# EAGLE design SenseLoRa LoRa Receiver V1.0 (EAGLE 6.1)
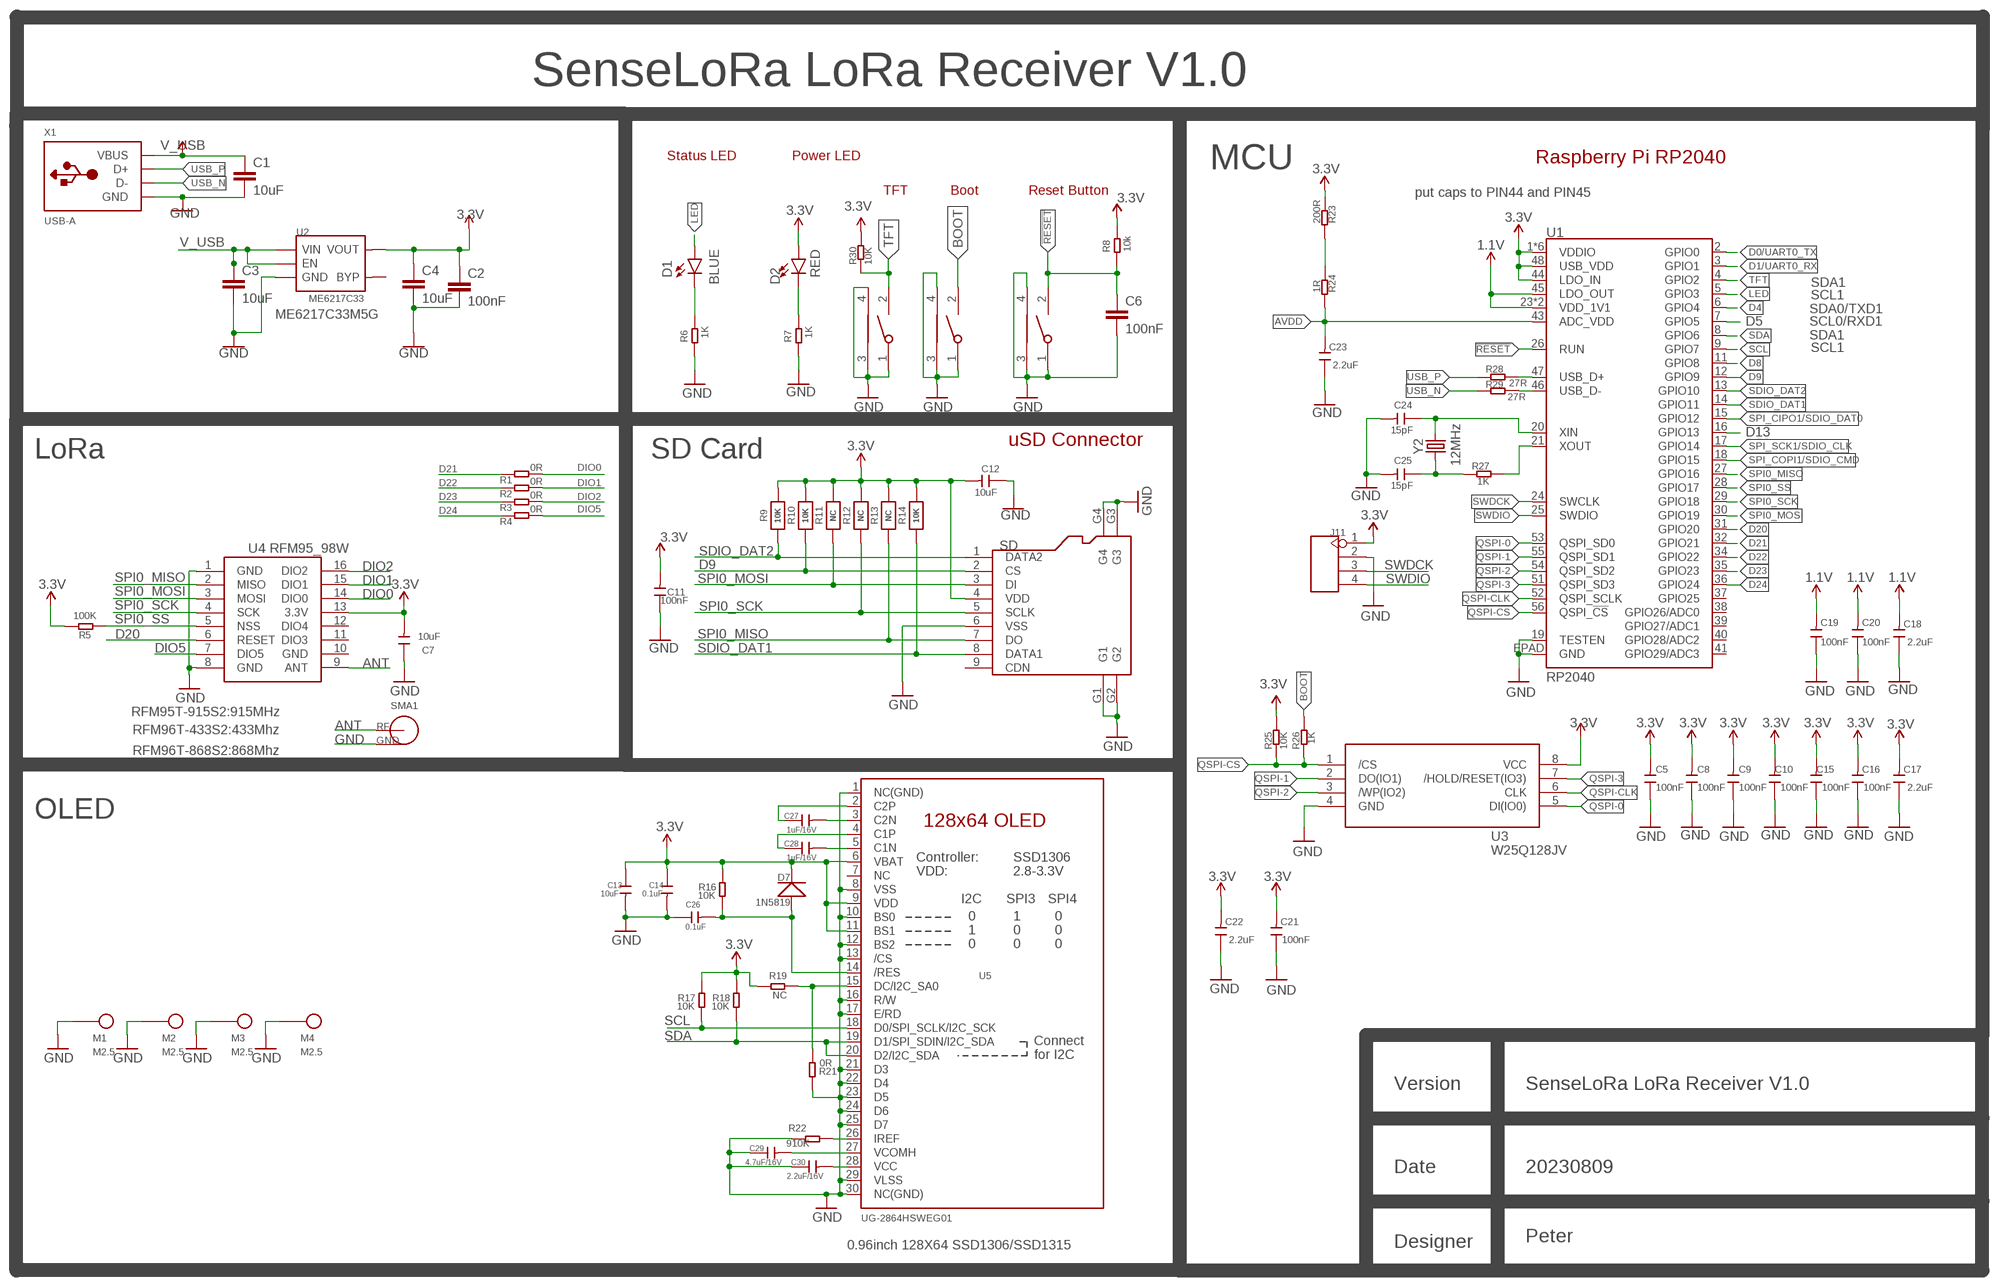
[diagram p0: schematic, sheet 1]

## Parts
BOOT  TS24CA  [2*4*3.5MM]
C1  10uF  C0603  [C0603]
C2  100nF  C0603  [C0603]
C3  10uF  C0603  [C0603]
C4  10uF  C0603  [C0603]
C5  100nF  C-0603  [C0603]
C6  100nF  C0603  [C0603]
C7  10uF  C-0603  [C0603]
C8  100nF  C-0603  [C0603]
C9  100nF  C-0603  [C0603]
C10  100nF  C-0603  [C0603]
C11  100nF  C-0603  [C0603]
C12  10uF  DISCRETE_C-0603  [DISCRETE_C0603]
C13  10uF  C-0603  [C0603]
C14  0.1uF  C-0603  [C0603]
C15  100nF  C-0603  [C0603]
C16  100nF  C-0603  [C0603]
C17  2.2uF  C-0603  [C0603]
C18  2.2uF  C-0603  [C0603]
C19  100nF  C-0603  [C0603]
C20  100nF  C-0603  [C0603]
C21  100nF  C-0603  [C0603]
C22  2.2uF  C-0603  [C0603]
C23  2.2uF  C-0603  [C0603]
C24  15pF  C-0603  [C0603]
C25  15pF  C-0603  [C0603]
C26  0.1uF  C-0603  [C0603]
C27  1uF/16V  C-0603  [C0603]
C28  1uF/16V  C-0603  [C0603]
C29  4.7uF/16V  C-0603  [C0603]
C30  2.2uF/16V  C-0603  [C0603]
D1  BLUE  LED-BLUE0603  [LED-0603]
D2  RED  LED-RED0603  [LED-0603]
D7  1N5819  D'0805'  [SOD323]
J11  HEADER-4P-60/35MILROUND  [4P-65/35ROUND]
M1  M2.5  [M2.5]
M2  M2.5  [M2.5]
M3  M2.5  [M2.5]
M4  M2.5  [M2.5]
R1  0R  R-0603  [0603]
R2  0R  R-0603  [0603]
R3  0R  R-0603  [0603]
R4  0R  R-0603  [0603]
R5  100K  R-0603  [0603]
R6  1K  R-0603  [0603]
R7  1K  R-0603  [0603]
R8  10k  R-0603  [0603]
R9  10K  RESISTOR_0603_NOOUT  [0603-NO]
R10  10K  RESISTOR_0603_NOOUT  [0603-NO]
R11  NC  RESISTOR_0603_NOOUT  [0603-NO]
R12  NC  RESISTOR_0603_NOOUT  [0603-NO]
R13  NC  RESISTOR_0603_NOOUT  [0603-NO]
R14  10K  RESISTOR_0603_NOOUT  [0603-NO]
R16  10K  R-0603  [0603]
R17  10K  R-0603  [0603]
R18  10K  R-0603  [0603]
R19  NC  R-0603  [0603]
R21  0R  R-0603  [0603]
R22  910K  R-0603  [0603]
R23  200R  R-0603  [0603]
R24  1R  R-0603  [0603]
R25  10K  R-0603  [0603]
R26  1K  R-0603  [0603]
R27  1K  R-0603  [0603]
R28  27R  R-0603  [0603]
R29  27R  R-0603  [0603]
R30  10K  R-0603  [0603]
RST  TS24CA  [2*4*3.5MM]
SD  HOLDER-MICROSD-9P  [9P-SMD-W/-RING]
SMA1  SMA-KWE  [SMA-KWE]
TFT  TS24CA  [2*4*3.5MM]
U1  RP2040  [QFN-56]
U2  ME6217C33  SPX3819  [SOT23-5]
U3  W25Q128JV  [SOIC-8-208MIL]
U4  RFM95_98W  RFM92_93W  [RFM92_93W]
U5  UG-2864HSWEG01  DISP_OLED_UG-2864HSWEG010.96"  [UG-2864HSWEG01_0.96IN_WRAPAROUND]
X1  USB-A  [MOLEX_480371000]
Y2  12MHz  CRYSTAL-12MHZ  [CRYSTAL-SMD-2X2.5MM]

## Nets
1.1V: C18.2 C19.2 C20.2 U1.23(VDD_1V1) U1.45(LDO_OUT) U1.50(VDD_1V1)
3.3V: C2.1 C4.1 C5.2 C7.2 C8.2 C9.2 C10.2 C11.2 C12.2 C13.1 C14.1 C15.2 C16.2 C17.2 C21.2 C22.2 D2.A D7.- J11.1 R5.2 R8.1 R9.2 R10.2 R11.2 R12.2 R13.2 R14.2 R16.2 R17.2 R18.2 R19.2 R23.2 R25.1 R30.1 SD.4(VDD) U1.1(VDDIO) U1.10(VDDIO) U1.22(VDDIO) U1.33(VDDIO) U1.42(VDDIO) U1.44(LDO_IN) U1.48(USB_VDD) U1.49(VDDIO) U2.5(VOUT) U3.8(VCC) U4.13(3.3V) U5.6(VBAT) U5.9(VDD) U5.11(BS1)
!RESET!: C6.1 R8.2 RST.2 U1.26(RUN)
ADC_VREF: R23.1 R24.2
ANT: SMA1.1(SIG) U4.9(ANT)
AVDD: C23.2 R24.1 U1.43(ADC_VDD)
BOOT: BOOT.2 R26.1
D0/UART0_TX: U1.2(GPIO0)
D1/UART0_RX: U1.3(GPIO1)
D4: U1.6(GPIO4)
D5: U1.7(GPIO5)
D8: U1.11(GPIO8)
D9: R10.1 SD.2(CS) U1.12(GPIO9)
D13: U1.16(GPIO13)
D20: U1.31(GPIO20) U4.6(RESET)
D21: R1.2 U1.32(GPIO21)
D22: R2.2 U1.34(GPIO22)
D23: R3.2 U1.35(GPIO23)
D24: R4.2 U1.36(GPIO24)
DIO0: R1.1 U4.14(DIO0)
DIO1: R2.1 U4.15(DIO1)
DIO2: R3.1 U4.16(DIO2)
DIO5: R4.1 U4.7(DIO5)
GND: BOOT.1 BOOT.3 BOOT.4 C1.2 C2.2 C3.2 C4.2 C5.1 C6.2 C7.1 C8.1 C9.1 C10.1 C11.1 C12.1 C13.2 C14.2 C15.1 C16.1 C17.1 C18.1 C19.1 C20.1 C21.1 C22.1 C23.1 C24.2 C25.2 C26.1 C29.1 C30.1 J11.2 M1.1 M2.1 M3.1 M4.1 R6.2 R7.2 R21.2 R22.2 RST.1 RST.3 RST.4 SD.6(VSS) SD.G1 SD.G2 SD.G3 SD.G4 SMA1.2(GND) SMA1.3(GND) SMA1.4(GND) SMA1.5(GND) TFT.1 TFT.3 TFT.4 U1.19(TESTEN) U1.EPAD(GND) U2.2(GND) U3.4(GND) U4.1(GND) U4.8(GND) U5.1(NC(GND)) U5.8(VSS) U5.10(BS0) U5.12(BS2) U5.13(/CS) U5.16(R/W) U5.17(E/RD) U5.21(D3) U5.22(D4) U5.23(D5) U5.24(D6) U5.25(D7) U5.29(VLSS) U5.30(NC(GND)) X1.4(GND)
LED: D1.A U1.5(GPIO3)
N$1: C24.1 U1.20(XIN) Y2.P3
N$2: D1.C R6.1
N$3: R19.1 R21.1 U5.15(DC/I2C_SA0)
N$4: R27.1 U1.21(XOUT)
N$5: C29.2 U5.27(VCOMH)
N$6: C25.1 R27.2 Y2.P1
N$7: D2.C R7.1
N$8: C30.2 U5.28(VCC)
N$9: R22.1 U5.26(IREF)
N$10: C27.2 U5.3(C2N)
N$13: C27.1 U5.2(C2P)
N$14: C28.1 U5.4(C1P)
N$15: C28.2 U5.5(C1N)
N$20: C26.2 D7.+ R16.1 U5.14(/RES)
QSPI-0: U1.53(QSPI_SD0) U3.5(DI(IO0))
QSPI-1: U1.55(QSPI_SD1) U3.2(DO(IO1))
QSPI-2: U1.54(QSPI_SD2) U3.3(/WP(IO2))
QSPI-3: U1.51(QSPI_SD3) U3.7(/HOLD/RESET(IO3))
QSPI-CLK [Clock]: U1.52(QSPI_SCLK) U3.6(CLK)
QSPI-CS: R25.2 R26.2 U1.56(QSPI_!CS!) U3.1(/CS)
SCL: R17.1 U1.9(GPIO7) U5.18(D0/SPI_SCLK/I2C_SCK)
SDA: R18.1 U1.8(GPIO6) U5.19(D1/SPI_SDIN/I2C_SDA) U5.20(D2/I2C_SDA)
SDIO_DAT1: R14.1 SD.8(DATA1) U1.14(GPIO11)
SDIO_DAT2: R9.1 SD.1(DATA2) U1.13(GPIO10)
SPI0_MISO: R13.1 SD.7(DO) U1.27(GPIO16) U4.2(MISO)
SPI0_MOSI: R11.1 SD.3(DI) U1.30(GPIO19) U4.3(MOSI)
SPI0_SCK: R12.1 SD.5(SCLK) U1.29(GPIO18) U4.4(SCK)
SPI0_SS: R5.1 U1.28(GPIO17) U4.5(NSS)
SPI_CIPO1/SDIO_DAT0: U1.15(GPIO12)
SPI_COPI1/SDIO_CMD: U1.18(GPIO15)
SPI_SCK1/SDIO_CLK: U1.17(GPIO14)
SWDCK: J11.3 U1.24(SWCLK)
SWDIO: J11.4 U1.25(SWDIO)
TFT: R30.2 TFT.2 U1.4(GPIO2)
USB_F_N: R29.1 U1.46(USB_D-)
USB_F_P: R28.1 U1.47(USB_D+)
USB_N: R29.2 X1.2(D-)
USB_P: R28.2 X1.3(D+)
V_USB: C1.1 C3.1 U2.1(VIN) U2.3(EN) X1.1(VBUS)
Unconnected: SD.9(CDN) U1.37(GPIO25) U1.38(GPIO26/ADC0) U1.39(GPIO27/ADC1) U1.40(GPIO28/ADC2) U1.41(GPIO29/ADC3) U2.4(BYP) U4.11(DIO3) U4.12(DIO4) U5.7(NC)

## Notes on the sheet
- SenseLoRa LoRa Receiver V1.0
- Status LED | Power LED | Raspberry Pi RP2040
- MCU
- TFT | Boot | Reset Button
- put caps to PIN44 and PIN45
- SDA1
- SCL1
- SDA0/TXD1
- ME6217C33M5G
- SCL0/RXD1
- SDA1
- SCL1
- uSD Connector
- LoRa | SD Card
- RFM95T-915S2:915MHz
- RFM96T-433S2:433Mhz
- RFM96T-868S2:868Mhz
- OLED
- Version | SenseLoRa LoRa Receiver V1.0
- Date | 20230809
- Peter
- 0.96inch 128X64 SSD1306/SSD1315 | Designer

## Power pins joined to a net without a drawn wire
GND: U4.10(GND)

## Library data of the parts
BOOT RST TFT = sale:TS24CA
C1-C4 C6 = Makerfabs-Peter:C0603
C5 C7-C11 C13-C30 = Discrete:C*: Ceramic Capacitors
C12 = A9G:DISCRETE_C*: Ceramic Capacitors
D1 = SparkFun-LED:LED-BLUE: Blue SMD LED Used in manufacturing of various products at SparkFun Packages: 0603 - SMD 0603 package [Product Link] <http://www.digikey.com/product-detail/en/SMLE12BC7TT86/511-1589-2-ND/1641808> 1206 - SMD1206 package [Product Link] <http://www.digikey.com/product-detail/en/lite-on-inc/LTST-C150TBKT/160-1643-1-ND/573584> SparkFun Products: ESP8266 Thing-Dev Board <https://www.sparkfun.com/products/13711> RedBoard <https://www.sparkfun.com/products/12757>; PROD_ID: DIO-08575
D2 = SparkFun-LED:LED-RED: Red SMD LED Used in manufacturing of most products at SparkFun Packages: 0603 - SMD 0603 package [Product Link] <http://docs.avagotech.com/docs/AV02-0551EN> 0603 SMART - SMD 0603 SMART package ( more efficient and expensive)[Product Link] <http://www.osram-os.com/Graphics/XPic2/00077099_0.pdf> 1206 - SMD1206 package [Product Link] <https://www.sparkfun.com/datasheets/DevTools/LilyPad/Q150OVS4.pdff> SparkFun Products: Pro Mini 328 -5V <https://www.sparkfun.com/products/821> RedBoard <https://www.sparkfun.com/products/12757> IOIO-OTG <https://www.sparkfun.com/products/13613>; PROD_ID: DIO-00819
D7 = Discrete:D*
J11 = Connector:HEADER-4P
M1-M4 = sale:M2.5
R1-R8 R16-R19 R21-R30 = Discrete:R*
R9-R14 = microbuilder:RESISTOR: Resistors For new designs, use the packages preceded by an '_' character since they are more reliable: The following footprints should be used on most boards: _0402 - Standard footprint for regular board layouts _0603 - Standard footprint for regular board layouts _0805 - Standard footprint for regular board layouts _1206 - Standard footprint for regular board layouts For extremely tight-pitch boards where space is at a premium, the following 'micro-pitch' footprints can be used (smaller pads, no silkscreen outline, etc.): _0402MP - Micro-pitch footprint for very dense/compact boards _0603MP - Micro-pitch footprint for very dense/compact boards _0805MP - Micro-pitch footprint for very dense/compact boards _1206MP - Micro-pitch footprint for very dense/compact boards
SD = Connector:HOLDER-MICROSD-9P
SMA1 = dragino:SMA-KWE
U1 = RP2040:RP2040: Raspberry Pi RP2040 MCU 56-pin 32-bit Microcontroller with 264kB of SRAM and external flash support up to 16MB Getting Started with the RP2040 <https://pico.raspberrypi.org/getting-started/> Dual-core ARM Cortex M0+ processor, flexible clock running up to 133 MHz 264kB of SRAM, and QSPI control of common flash memory USB 1.1 Host and Device support Low-power sleep and dormant modes Drag & drop programming using mass storage over USB 26 multi-function GPIO pins 2×SPI, 2×I2C, 2×UART, 3×12-bit ADC, 16×controllable PWM channels Accurate clock and timer on-chip Temperature sensor Accelerated floating point libraries on-chip 8×Programmable IO (PIO) state machines for custom peripheral support; PROD_ID: IC-15502
U2 = IC:SPX3819
U3 = self:W25Q128JV
U4 = dragino:RFM92_93W
U5 = adafruit_display:DISP_OLED_UG-2864HSWEG01: UG-2864HSWEG01 OLED display Both 1.3" and 0.96" models share the same FPC tab footprint, only the screen dimensions vary.
X1 = adafruit:USB-A: USB type A 'plug' Used for things that can directly connect to a USB port, say USB key
Y2 = SparkFun-Clocks:CRYSTAL-12MHZ: 12.0MHz Crystal Frequency: 12.0MHz Frequency Tolerance: ±20ppm Load Capacitance: 18pF SparkFun Products: SparkFun Logomatic <https://www.sparkfun.com/products/12772> Pocket AVR Programmer <https://www.sparkfun.com/products/9825>; PROD_ID: XTAL-15540

## Net classes
0 default: width 0.203 mm
2 Clock: width 0.089 mm, clearance 0.178 mm

## Board
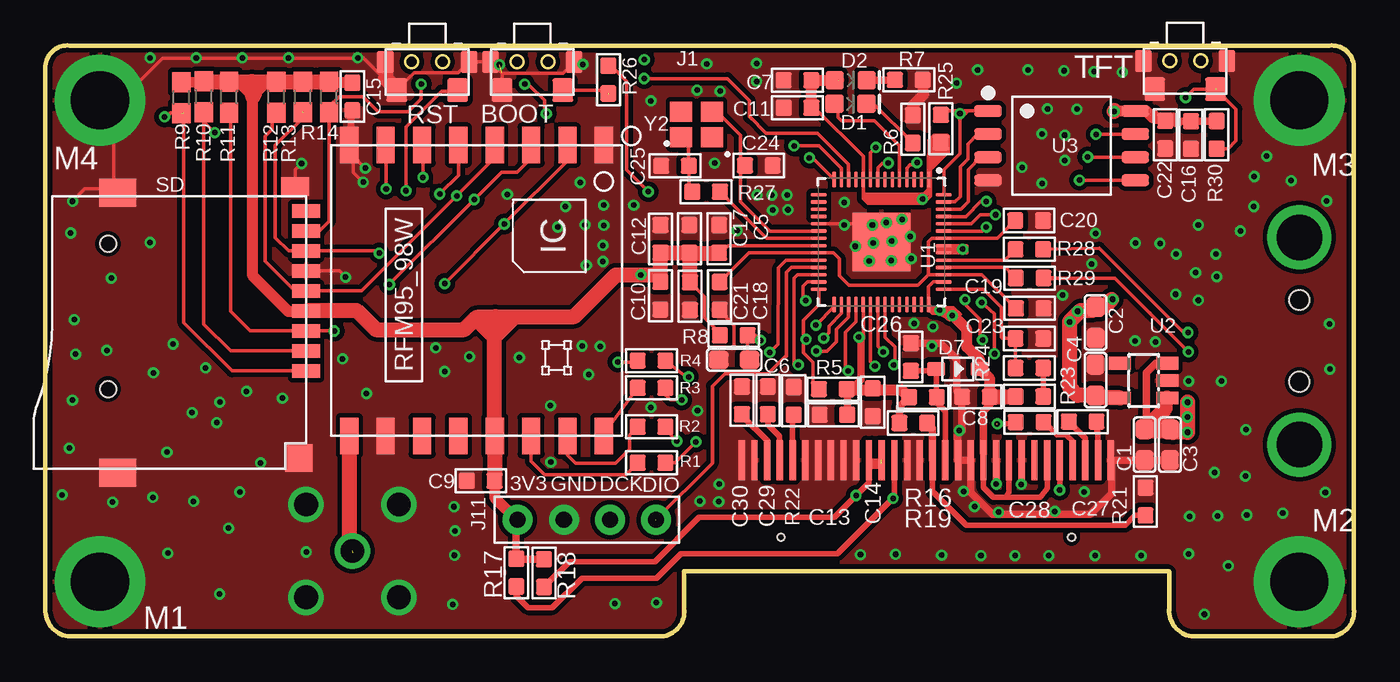
[diagram p1: board, top side]
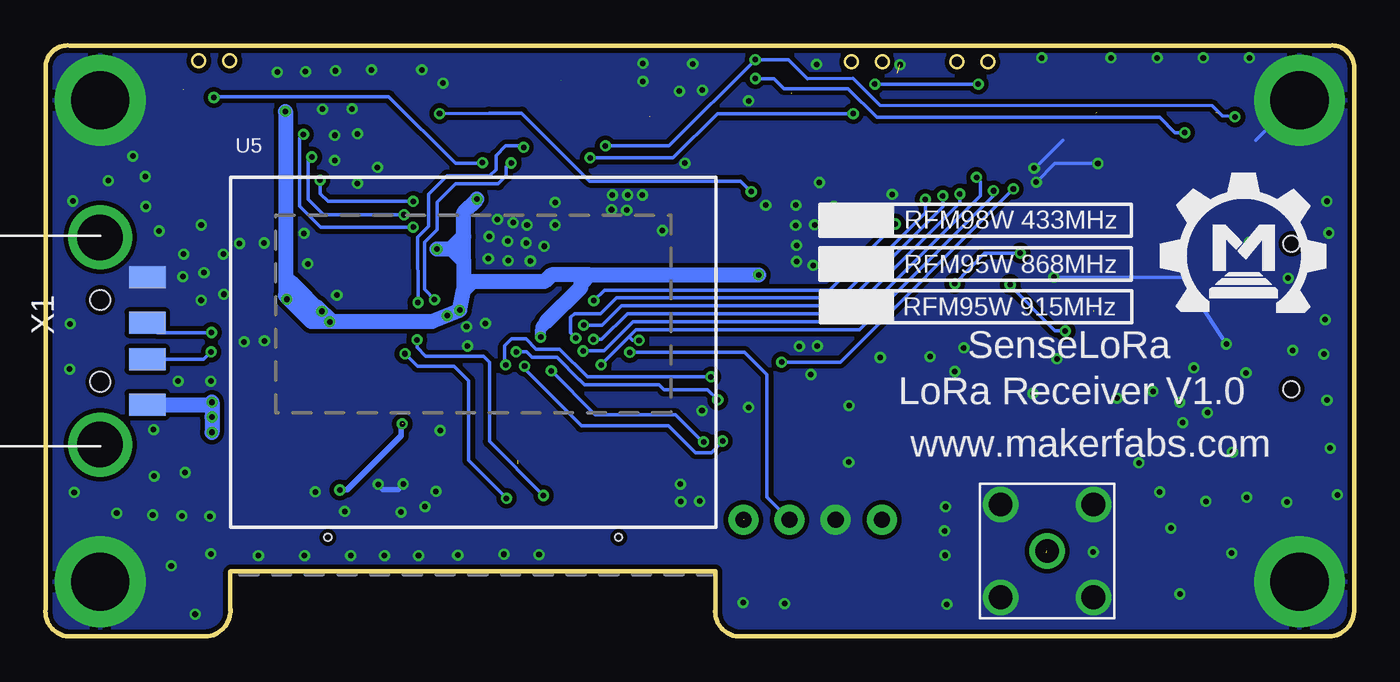
[diagram p2: board, bottom side, seen from below]

Size 72.01 x 32.51 mm. Coordinates in mm from the lower left corner, seen from the top.
Outline: 70.78,0 arc90 72,1.5 72,31.4 arc90 70.66,32.5 1.32,32.5 arc90 0,31.4 0,1.5 arc90 1.35,0
Outline: 61.84,1.42 61.84,3.55
Outline: 35.14,1.39 35.14,3.58
Outline: 61.81,3.57 35.16,3.57
Outline: 33.94,0 33.92,0
Outline: 33.92,0 1.33,0
Outline: 33.92,0 arc90 35.15,1.5
Outline: 61.82,1.5 arc90 63.17,0
Outline: 70.75,0 63.17,0
Outline: 63.17,0 63.1,0
Copper layers (1*16): Top 0.035mm / dielectric 1.5mm / Bottom 0.035mm
Design rules: minimum track width 6mil, minimum drill 12mil, track to track 6mil, track to pad 6mil, pad to pad 6mil, via to via 6mil, smd to smd 0mil, copper to edge 8mil, drill to drill 8mil, minimum pad ring 10mil, minimum via ring 6mil, stop-mask expansion 4mil, vias tented up to drill 30mil, thermal gap 0mil

### Footprints (pad centres in the part's own frame; a part is rotated, then mirrored left to right if it is on the bottom)
2*4*3.5MM = smd 1.15 x 1.3: 1 -1.675,0; 2 1.675,0 | smd 0.9 x 1.2: 3 2.3,1.55; 4 -2.3,1.55
C0603 = smd 1.1 x 1: 1 -0.85,0; 2 0.85,0
C0603' = smd 0.889 x 0.889: 1 -0.762,0; 2 0.762,0
DISCRETE_C0603 = smd 0.889 x 0.889: 1 -0.762,0; 2 0.762,0
LED-0603 = smd 1 x 1: A -0.877,0; C 0.877,0
SOD323 = smd 1 x 0.8: + -1.2,0; - 1.2,0
4P-65/35ROUND = drill 0.889 pad 1.651: 1 0,3.81; 2 0,1.27; 3 0,-1.27; 4 0,-3.81
M2.5 = drill 3.2 pad 5: 1 0,0
0603 = smd 0.889 x 0.889: 1 -0.762,0; 2 0.762,0
0603-NO = smd 1.1 x 1: 1 -0.85,0; 2 0.85,0
9P-SMD-W/-RING = smd 1.524 x 0.762: 1 0,4.4; 2 0,3.3; 3 0,2.2; 4 0,1.1; 5 0,0; 6 0,-1.1; 7 0,-2.2; 8 0,-3.3; 9 0,-4.4 | smd 1.524 x 1.016: G1 0.6,-5.746 | smd 2.032 x 1.524: G2 10.373,-5.4; G3 10.373,10 | smd 1.524 x 1.524: G4 0.392,9.181 | hole 0.889: 10.9,-2.6; 10.9,5.4
SMA-KWE = drill 1.3: 1 0,0; 2 -2.55,2.55; 3 2.55,2.55; 4 -2.55,-2.55; 5 2.55,-2.55
QFN-56 = smd 0.875 x 0.2: 1 -3.437,2.6; 2 -3.437,2.2; 3 -3.437,1.8; 4 -3.437,1.4; 5 -3.437,1; 6 -3.437,0.6; 7 -3.437,0.2; 8 -3.437,-0.2; 9 -3.437,-0.6; 10 -3.437,-1; 11 -3.437,-1.4; 12 -3.437,-1.8; 13 -3.437,-2.2; 14 -3.437,-2.6; 29 3.437,-2.6; 30 3.437,-2.2; 31 3.437,-1.8; 32 3.437,-1.4; 33 3.437,-1; 34 3.437,-0.6; 35 3.437,-0.2; 36 3.437,0.2; 37 3.437,0.6; 38 3.437,1; 39 3.437,1.4; 40 3.437,1.8; 41 3.437,2.2; 42 3.437,2.6 | smd 0.2 x 0.875: 15 -2.6,-3.437; 16 -2.2,-3.437; 17 -1.8,-3.437; 18 -1.4,-3.437; 19 -1,-3.437; 20 -0.6,-3.437; 21 -0.2,-3.437; 22 0.2,-3.437; 23 0.6,-3.437; 24 1,-3.437; 25 1.4,-3.437; 26 1.8,-3.437; 27 2.2,-3.437; 28 2.6,-3.437; 43 2.6,3.437; 44 2.2,3.437; 45 1.8,3.437; 46 1.4,3.437; 47 1,3.437; 48 0.6,3.437; 49 0.2,3.437; 50 -0.2,3.437; 51 -0.6,3.437; 52 -1,3.437; 53 -1.4,3.437; 54 -1.8,3.437; 55 -2.2,3.437; 56 -2.6,3.437 | smd 3.2 x 3.2: EPAD 0,0
SOT23-5 = smd 0.69 x 1.2: 1 -0.95,-1.3; 2 0,-1.3; 3 0.95,-1.3; 4 0.95,1.3; 5 -0.95,1.3
SOIC-8-208MIL = smd 1.5 x 0.635: 1 -4.05,1.905; 2 -4.05,0.635; 3 -4.05,-0.635; 4 -4.05,-1.905; 5 4.05,-1.905; 6 4.05,-0.635; 7 4.05,0.635; 8 4.05,1.905
RFM92_93W = smd 2 x 1: 1 -8,7; 2 -8,5; 3 -8,3; 4 -8,1; 5 -8,-1; 6 -8,-3; 7 -8,-5; 8 -8,-7; 9 8,-7; 10 8,-5; 11 8,-3; 12 8,-1; 13 8,1; 14 8,3; 15 8,5; 16 8,7
UG-2864HSWEG01_0.96IN_WRAPAROUND = smd 0.35 x 2.2 bottom: 1 -10.15,-1.2; 2 -9.45,-1.2; 3 -8.75,-1.2; 4 -8.05,-1.2; 5 -7.35,-1.2; 6 -6.65,-1.2; 7 -5.95,-1.2; 8 -5.25,-1.2; 9 -4.55,-1.2; 10 -3.85,-1.2; 11 -3.15,-1.2; 12 -2.45,-1.2; 13 -1.75,-1.2; 14 -1.05,-1.2; 15 -0.35,-1.2; 16 0.35,-1.2; 17 1.05,-1.2; 18 1.75,-1.2; 19 2.45,-1.2; 20 3.15,-1.2; 21 3.85,-1.2; 22 4.55,-1.2; 23 5.25,-1.2; 24 5.95,-1.2; 25 6.65,-1.2; 26 7.35,-1.2; 27 8.05,-1.2; 28 8.75,-1.2; 29 9.45,-1.2; 30 10.15,-1.2 | hole 0.4: -8,-5.45; 8,-5.45
MOLEX_480371000 = smd 1.2 x 2: 1 3.5,2.6; 2 1,2.6; 3 -1,2.6; 4 -3.5,2.6 | drill 2.5: M1 -5.7,0; M2 5.7,0 | hole 1.1: -2.25,0; 2.25,0
CRYSTAL-SMD-2X2.5MM = smd 1.2 x 1.1: P1 0.846,0.69; P2 -0.854,0.69; P3 -0.854,-0.71; P4 0.846,-0.71

### Placement (x,y rotation side)
BOOT  26.8,30.05 0 top
C1  60.48,10.54 270 top
C2  57.79,17.27 270 top
C3  61.88,10.54 270 top
C4  57.79,14.1 90 top
C5  100nF  [C0603']  37.07,21.87 270 top
C6  37.9,15.22 180 top
C7  10uF  [C0603']  41.38,30.59 0 top
C8  100nF  [C0603']  51.2,13.18 0 top
C9  100nF  [C0603']  23.95,8.56 0 top
C10  100nF  [C0603']  33.84,18.74 90 top
C11  100nF  [C0603']  41.39,29.08 0 top
C12  33.85,21.86 270 top
C13  10uF  [C0603']  43.36,12.19 180 top
C14  0.1uF  [C0603']  45.52,12.88 270 top
C15  100nF  [C0603']  16.89,29.69 90 top
C16  100nF  [C0603']  63.03,27.58 90 top
C17  2.2uF  [C0603']  35.44,21.87 270 top
C18  2.2uF  [C0603']  37.1,18.73 90 top
C19  100nF  [C0603']  54.16,18.04 180 top
C20  100nF  [C0603']  54.13,22.88 180 top
C21  100nF  [C0603']  35.47,18.72 90 top
C22  2.2uF  [C0603']  61.61,27.6 90 top
C23  2.2uF  [C0603']  54.14,16.39 180 top
C24  15pF  [C0603']  39.25,25.9 0 top
C25  15pF  [C0603']  34.64,25.88 180 top
C26  0.1uF  [C0603']  47.63,15.37 270 top
C27  1uF/16V  [C0603']  57.07,11.81 180 top
C28  1uF/16V  [C0603']  54.15,11.79 180 top
C29  4.7uF/16V  [C0603']  39.75,12.98 270 top
C30  2.2uF/16V  [C0603']  38.33,12.98 270 top
D1  44.29,29.29 0 top
D2  44.31,30.59 0 top
D7  50.22,14.71 0 top
J11  29.8,6.41 90 top
M1  3,3 0 top
M2  69,3 0 top
M3  69,29.5 0 top
M4  3,29.5 0 top
R1  33.35,9.55 0 top
R2  33.35,11.53 0 top
R3  33.35,13.67 0 top
R4  33.35,15.17 0 top
R5  43.33,13.6 0 top
R6  47.73,27.9 90 top
R7  47.51,30.61 0 top
R8  37.88,16.57 0 top
R9  7.49,29.64 90 top
R10  8.72,29.69 90 top
R11  10.11,29.67 90 top
R12  12.71,29.66 90 top
R13  14.16,29.67 90 top
R14  15.61,29.67 90 top
R16  48.29,13.16 180 top
R17  25.91,3.51 90 top
R18  27.43,3.48 90 top
R19  47.75,11.74 180 top
R21  60.53,7.42 90 top
R22  41.17,12.96 90 top
R23  54.15,13.2 180 top
R24  54.14,14.76 0 top
R25  49.28,27.93 90 top
R26  30.97,30.62 90 top
R27  36.35,24.46 180 top
R28  54.14,21.29 0 top
R29  54.16,19.71 0 top
R30  64.44,27.59 270 top
RST  21.01,30.05 0 top
SD  14.35,19 180 top
SMA1  16.89,4.7 0 bottom
TFT  62.71,30.1 0 top
U1  46,21.7 270 top
U2  60.43,14.07 90 top
U3  55.91,27 0 top
U4  23.72,19.03 270 top
U5  48.46,10.9 0 bottom
U$1  [MAKERFABS_0.3]  10.19,17.86 0 bottom
X1  69,16.25 270 bottom
Y2  35.82,28.16 180 top

### Tracks (layer width: path | path; a pad name or v marks a point on that pad's centre or on a via)
1.1V
  Top 0.203: C18.2 38.7,21.1 U1.23 43.37,21.1 43.69,20.78 43.69,19.84 44.22,19.31 48.01,19.31 48.59,19.89 | 48.59,19.89 48.59,21.72 48.77,21.9 U1.50 52.39,21.9 C20.2 | 48.59,19.89 48.6,19.9 U1.45 51.54,19.9 C19.2
3.3V  (via drill 0.3)  (2 unrouted)
  Top 0.203: U1.48 U1.49 49.63,21.3 | U1.1 48.6,26.49 R25.1 | C11.2 42.33,29.08 45,26.41 U1.10 45,24.38 | 45,17.16 U1.33 45,16.39 44.92,16.46 v44.76,16.46 | v50.47,21.3 49.63,21.3 | v48.26,24.06 45.29,24.06 45,24.35 45,24.38 | v48.26,24.06 48.29,24.06 48.6,24.37 U1.1 | 49.28,21.49 50.7,21.49 50.7,21.31 | 50.7,21.31 50.7,21.11 49.1,21.11 49.1,21.49 49.28,21.49 | 49.28,21.49 49.28,21.19 49.63,21.19 | 49.63,21.3 49.64,21.31 50.7,21.31 | U1.44 48.86,19.5 48.6,19.24 U1.42 | U1.1 48.6,24.39 v48.26,24.06 | 48.62,25.78 48.62,24.61 48.31,24.31 45.14,24.31 45.01,24.44 45.01,24.41 | 48.62,25.78 48.62,27.28 48.9,27.56 49.63,27.56 49.68,27.51 49.68,26.65 48.69,25.66 48.69,24.21 48.31,23.83 45.26,23.83 45.01,24.08 45.01,24.39 | 45.01,24.41 45.21,24.21 48.29,24.21 48.31,24.18 48.31,23.98 48.29,23.95 45.36,23.95 45.19,24.13 | 48.62,25.78 49.56,26.72 49.35,26.72 48.72,26.09 48.72,26.29 49.17,26.75 49.02,26.75 48.72,26.44 48.72,27.21 48.82,27.31 48.82,26.8 48.77,26.75 | 51.61,10.06 51.61,9.2 | 51.61,9.2 | U3.8 61.04,28.9 | 61.04,28.9 61.6,28.35 62.99,28.35 | 62.99,28.35 63.02,28.32 | 61.04,28.9 61.04,28.84 60.83,28.63 | C22.2 63.02,28.36 C16.2 62.99,28.35 | C14.1 44.13,13.64 R5.2 44.13,13.57 44.3,13.57 | R17.2 25.91,5.08 25.88,5.11 | 25.98,6.38 J11.1 | D2.A 43.46,30.56 43.59,30.56 43.64,30.61 | 43.64,30.61 43.64,30.58 43.61,30.56 | 43.64,30.64 43.64,30.61 | 43.64,30.61 43.66,30.58 | R8.1 37.11,16.69 36.27,17.53 36.27,18.68 C21.2 | U1.42 48.6,18.01 48.82,17.78 50.29,17.78 49.91,17.66 50.34,17.71 49.99,18.06 | 49.99,18.06 49.96,18.09 48.77,18.09 U1.42 | U1.42 48.6,18.18 48.87,17.91 49.84,17.91 49.86,17.94 | 49.86,17.94 49.99,18.06
  Top 0.203: 49.86,17.94 arc60 v49.21,17.95 | v49.9,17.64 49.92,17.62 | 56.97,17.94 56.85,17.94 v56.79,17.88 57.04,18.12 C2.1 | 56.36,17.33 56.67,17.33 | C4.1 57.79,13.24 57.76,13.21 | 45,24.38 45.01,24.39 | 45.01,24.39 45.01,24.41 | 49.78,17.63 49.89,17.63 v49.9,17.64 | 49.89,17.71 49.89,17.66 v49.9,17.64 | U1.22 37.55,21.5 36.83,20.78 36.83,20.87 C5.2 | 23.7,17.5 23.7,17.53
  Top 0.305: U5.11 51.61,9.2 51.61,8.21 52.17,7.65 52.86,7.65 | 52.86,7.65 54.74,7.65 55.12,8.16 U5.6 | U5.9 53.01,7.93 52.86,7.65
  Top 0.406: R5.2 44.35,13.58 44.88,14.11 44.88,16.34 v44.76,16.46 | C8.2 51.96,12.75 51.61,12.4 51.61,10.06 | R30.1 63.04,28.35 | 63.02,28.35 62.97,28.3 62.99,28.3 63.04,28.35 | 63.04,28.35 63.02,28.35 | 63.02,28.35 62.99,28.35 61.49,28.35 | R19.2 46.99,12.63 R16.2 | C13.1 44.12,13.39 44.3,13.57 | R18.2 25.98,4.25 25.88,4.35 25.88,5.11 25.88,6.2 26.04,6.35 26.01,6.35 25.98,6.38
  Top 0.61: C11.2 C7.2 43.64,30.59 | 11.41,29.67 11.41,29.75 11.58,29.92 | 11.58,29.92 12.14,30.48 | 11.38,29.54 11.38,29.77 10.67,30.48 10.67,30.51 | R9.2 10.99,30.52 11.58,29.92 | 11.58,29.92 11.58,29.75 11.38,29.54 | 11.38,29.54 11.38,19.87 13.36,17.88 14.35,17.88 14.4,17.94 | C15.2 15.68,30.46 R14.2 | 58.84,28.92 60.54,28.92 60.83,28.63 60.96,28.5 62.05,28.5 62.28,28.27 | 44.35,13.58 47.1,13.58 R16.2 | 24.72,8.57 24.72,7.64 25.98,6.38 26.04,6.33 | C8.2 51.96,14.16 D7.- 51.42,15.21 50.7,15.93 50.7,16.89 49.89,17.71 | 49.92,17.62 v49.21,17.95 | 49.78,17.63 49.76,17.66
  Top 0.813: 11.41,29.67 11.41,30.46 11.35,30.51 | R10.2 8.74,30.52 R11.2 11.35,30.51 | 11.35,30.51 R12.2 12.72,30.52 R13.2 R14.2 | 24.72,17.54 U4.13 24.72,8.57 C9.2 | 24.72,17.54 24.77,17.58 29.09,17.58 31.39,19.89 v32.77,19.89 33.68,19.89 33.84,20.04 | C10.2 33.84,20.04 | 33.84,20.04 33.84,21.09 C12.2 C17.2 35.47,21.08 | C21.2 35.47,21.08 | 35.47,21.08 37.04,21.08 C5.2 | 58.84,28.92 v58.8,28.88 | C8.2 53.37,13.18 R23.2 | 23.7,17.5 23.7,17.48 | 23.7,17.48 24.71,16.46 24.71,16.49 25.81,17.58 | 24.72,17.54 23.76,17.54 23.7,17.48 | 23.7,17.53 23.04,16.87 18.19,16.87 17.12,17.94 14.4,17.94 | U2.5 57.85,13.12 57.76,13.21 57.71,13.26 56.79,13.26 56.36,13.69 v56.36,17.3 56.36,17.33 56.97,17.94 57.58,17.94 57.76,18.11 58.24,18.11 58.67,18.55
  Bottom 0.203: 57.05,18.11 57.02,18.11 v56.79,17.88 | v58.73,18.55 58.73,18.6 58.69,18.63
  Bottom 0.61: 44.45,17.33 44.76,17.02 44.76,16.89 | v44.76,16.46 44.76,16.89 | 44.76,16.89 44.04,17.61 44.22,17.61 44.53,17.3
  Bottom 0.813: 42.04,19.89 44.17,19.89 44.55,19.51 48.54,19.51 49,19.05 | 42.04,19.89 v32.77,19.89 | v58.8,28.88 58.8,18.75 58.69,18.63 57.38,17.33 56.26,17.33 | 49,20.66 49.64,21.3 v50.47,21.3 | 49,20.66 49,22 | 49,22 49.71,21.29 | 49,22 49,23.32 v48.26,24.06 | 56.26,17.33 57.05,18.11 57.1,18.11 58.12,19.13 58.17,19.13 58.52,19.48 58.5,19.48 57.99,18.98 | 44.45,17.33 44.43,17.33 42.55,19.2 42.55,19.38 42.04,19.89 | 56.26,17.33 50.72,17.33 v49.21,17.95 49,19.05 | 49,20.66 49,19.05
!RESET!  (via drill 0.3)
  Top 0.203: U1.26 41.38,19.9 41.2,19.71 41.2,14.94 v41.43,14.94 | v19.84,24.51 19.84,28.04 21.79,30 22.63,30 RST.2 | C6.1 38.64,15.33 R8.2 39.06,16.57 v39.35,16.28
  Bottom 0.203: 39.89,16.48 39.5,16.87 27.2,16.87 19.84,24.23 v19.84,24.51 | 39.89,16.48 v41.43,14.94 | v39.35,16.28 39.7,16.28 39.89,16.48
ADC_VREF
  Top 0.305: 54.89,13.18 R23.1 R24.2
ANT  (1 unrouted)
  Top 0.813: U4.9 16.72,4.82 16.94,4.6
AVDD
  Top 0.203: R24.1 C23.2 53.36,16.41 52.65,16.41 52.6,16.46 52.6,18.11 51.62,19.1 U1.43
BOOT  (1 unrouted)
  Top 0.203: BOOT.2 30.79,30.05 30.96,29.87
D9  (via drill 0.3)  (1 unrouted)
  Top 0.203: U1.12 44.2,25.96 42.47,27.69 39.65,27.69 38.76,28.58 | R10.1 8.72,28.34 | SD.2 10.19,15.7 8.71,17.17 R10.1 | R10.1 8.72,28.32 v9.32,27.71 | v32.94,30.69 37.52,30.69 38.74,29.47 38.74,28.58 38.84,28.48
  Bottom 0.203: v9.32,27.71 9.86,27.71 10.69,28.55 26.26,28.55 27.84,30.13 31.37,30.13 31.93,30.69 v32.94,30.69
D20  (via drill 0.3)
  Top 0.203: U1.31 44.2,17.55 43.54,16.89 43.54,16.21 43,15.68 42.44,15.68 v42.42,15.7 | v20.78,25.25 20.78,26.98 U4.6
  Bottom 0.203: v42.42,15.7 41.28,15.7 39.68,17.3 27.48,17.3 20.55,24.23 20.55,25.02 v20.78,25.25
D21  (via drill 0.3)
  Top 0.203: U1.32 44.6,17.32 44.02,16.74 44.02,14.76 v44.17,14.61 | R1.2 34.65,9.55 v35.79,10.7
  Bottom 0.203: v35.79,10.7 35.84,10.7 37.34,12.2 41.76,12.2 v44.17,14.61
D22  (via drill 0.3)
  Top 0.203: R2.2 34.11,11.38 v34.75,10.75 | U1.34 45.4,15.11 v45.64,14.86
  Bottom 0.203: v34.75,10.75 34.75,10.72 35.36,10.11 36.25,10.11 37.72,11.59 42.52,11.59 45.64,14.71 v45.64,14.86
D23  (via drill 0.3)
  Top 0.203: U1.35 45.8,15.95 v46.1,15.65 | v35.01,13.01 34.39,13.01 33.99,13.41 33.99,13.54 34.09,13.64 | 34.14,13.69 R3.2 | R3.2 34.09,13.64 | 34.09,13.64 34.09,13.67 34.11,13.69 R3.2
  Bottom 0.203: v46.1,15.65 45.54,15.65 45.24,15.34 43.87,15.34 42.65,14.12 42.62,14.12 42.34,13.85 38.25,13.85 37.97,13.57 35.57,13.57 v35.01,13.01
D24  (via drill 0.3)
  Top 0.203: U1.36 46.2,16.47 46.74,15.93 46.74,14.99 v46.69,14.94 | v35.39,14.28 35.24,14.28 R4.2
  Bottom 0.203: v46.69,14.94 46.74,14.99 46.74,15.98 46.36,16.36 45.57,16.36 45.01,15.8 43.71,15.8 42.19,14.28 v35.39,14.28
DIO0
  Top 0.203: U4.14 26.72,9.63 27.46,8.89 31.95,8.89 32.59,9.53 R1.1
DIO1
  Top 0.203: U4.15 28.72,9.96 29.16,9.53 31.37,9.53 32.13,10.29 32.13,11.08 R2.1
DIO2
  Top 0.203: U4.16 30.75,11 | U4.16 30.78,10.98 | R3.1 31.06,11.61 arc90 30.89,11.43 30.89,11.19 arc-90 U4.16
DIO5  (via drill 0.3)
  Top 0.203: U4.7 18.75,27.01 v18.75,24.61 | v31.5,15.09 32.59,15.09 R4.1
  Bottom 0.203: v18.75,24.61 28.27,15.09 v31.5,15.09
GND  (via drill 0.3)  (1 unrouted)
  Top 0.203: U1.19 45,22.7 U1.EPAD | SD.G1 13.75,25.66 v14.1,26.01 | SD.6 16.17,20.1 v16.51,19.76 | U4.8 16.72,28.77 C15.1 | C15.1 16.89,27.61 16.94,27.56 16.94,25.54 v17.49,24.99 | BOOT.1 25.12,30.98 | 25.12,30.98 BOOT.4 RST.3 22.7,30.99 20.3,30.99 19.36,30.05 RST.1 | 18.71,30.68 18.63,30.68 17.5,31.8 6.45,31.8 3.76,29.11 3.76,29.06 | 3.76,24.61 SD.G2 | 3.76,24.61 3.76,29.06 | 3.76,29.06 3.56,29.26 3.24,29.26 M4.1 | C15.1 16.89,26.47 v17.6,25.76 | 3.76,24.61 2.17,24.61 v1.49,23.94 | 25.12,30.98 28.47,30.98 BOOT.3 | U5.8 53.71,9.71 53.7,9.73 | 53.7,9.81 53.7,9.68 53.7,9.3 53.65,9.25 | 53.7,9.83 53.7,9.98 | C18.1 37.1,17.92 37.9,17.12 37.9,15.95 37.77,15.83
  Top 0.305: v53.7,8.36 53.7,9.68 53.7,9.73 53.7,9.81 53.7,9.83 53.72,9.86
  Top 0.406: 58.65,9.48 58.67,9.45 58.67,7.88 57.51,6.71 52.1,6.71 50.91,7.89 U5.12 U5.13 50.19,9.72 50.19,11.05 50.44,11.3 C8.1 50.14,13.47 50.14,15.24 49.25,16.13 C26.1 | U5.10 52.31,8.4 v52.32,8.38 | U5.1 59.85,9.7 C3.2
  Top 0.61: R6.2 47.73,29.21 48.31,29.8 48.31,30.57 R7.2
  Top 0.813: RST.4 18.71,30.68 RST.1
  Bottom 0.203: v16.51,19.76 9.44,19.76 v7.02,16.08 | v14.1,26.01 16.47,26.01 v17.49,24.99 | v17.6,25.76 17.55,25.76 16.03,27.28 | 5.41,27.28 3.76,28.93
  Bottom 0.305: v52.32,8.38 52.32,8.36 52.6,8.08 53.42,8.08 v53.7,8.36
  other vias: 11.06,13.48 6.68,10.13 6.73,4.58 5.91,7.64 27.78,12.69 1.32,10.36 1.67,15.52 1.39,22.19 10.08,5.95 28.19,22.52 21.97,14.57 29.42,24.97 25.42,24.31 22.41,1.76 3.62,19.71 8.81,14.77 0.92,7.79 9.6,12.88 55.14,29.02 1.49,13 3.69,7.39 9.58,2.33 29.68,22.64 29.89,14.41 54.84,24.92 56.09,27.57 56.09,26.18 53.74,25.8 56.77,29.01 54.84,27.64 3.38,15.73 1.59,17.43 30.72,23.72 8.07,12.31 29.76,20.41 13.04,13.1 5.94,14.5 5.75,21.66 33.62,1.85 16.35,15.26 17.67,13.36 31.33,1.8 21.48,15.87 30.52,15.95 28.61,23.65 33.31,29.46 30.72,22.6 38.06,22.33 43.96,23.87 44.57,21.46 45.33,20.65 46.55,20.67 47.64,20.78 47.59,22 47.13,22.93 45.51,22.63 46.27,22.76 46.57,21.74 45.56,21.64 59.98,21.64 57.57,20.5 66.51,25.3 22.53,5.81 22.51,4.46 22.48,7.13 9.42,11.75 14.35,4.64 11.84,9.54 36.82,26.03 64.4,21.03 65.75,22.3 62.22,21.03 68.54,25.07 62.19,18.82 63.29,20.01 63.44,18.49 64.45,19.79 62.9,4.55 62.9,14.04 65.09,3.88 64.71,14.04 64.33,9.02 50.52,7.98 29.58,31.47 24.98,31.44 36.39,31.49 39.13,31.52 51.3,31.16 54.07,31.16 70.5,23.95 66.03,8.81 64.51,6.63 61.33,21.61 55.97,18.77 57.77,22.17 61.08,16.2 59.96,16.25 62.96,6.6 66.11,6.68 51.12,7.14 57.16,7.95 44.85,4.49 46.78,4.52 49.32,4.47 51.47,4.44 53.35,4.44 55.21,4.44 36.01,7.44 37.05,7.42 37.07,8.38 33.31,12.6 35.88,12.42 26.07,15.34 23.33,15.39 29.53,15.98 30.67,21.51 30.67,20.62 32.37,23.72 35.85,30.05 37.12,30 39.16,24.28 39.97,24.28 40.81,24.28 40.86,23.47 40.02,23.44 39.13,30.53 50.13,30.43 43.96,22.63 63.77,1.22 66.49,23.65 70.65,17.19 70.68,14.71 66.05,11.38 68.09,6.78 70.42,7.92 56.05,31.11 57.7,31.06 59.25,31.04 67.2,26.41 63.44,22.63 27.81,9.58 8.15,7.42 47.79,17.22 48.83,17.04 48.78,15.98 52.44,6.83 55.54,6.88 50.28,11.33 57.75,4.44 60.29,4.44 10.69,7.94 5.75,31.82 8.29,31.82 10.83,31.82 13.37,31.82 17.18,31.82
  pour Top (isolate 0.254, rank 6): -1.68,33.7 74.58,33.22 73.72,-1.41 -1.86,-1.31 -1.66,33.7
  pour Bottom (isolate 0.254, rank 6): -2.54,35.33 76.53,35.28 76.25,-3.02 -2.84,-2.49
LED
  Top 0.203: D1.A 43.61,29.1 43.61,28.55 43.79,28.38 45.62,28.38 47,27 U1.5
N$1
  Top 0.203: U1.20 39.86,22.3 38.25,23.9 38.25,25.9 C24.1 38.49,26.22 38.25,26.22 38.25,27.56 37.24,28.58 36.96,28.58 Y2.P3
N$2
  Top 0.203: D1.C 45.57,29.29 R6.1
N$3
  Top 0.305: R21.1 59.94,6.66 59.41,6.12 50.67,6.12 48.82,7.98 U5.15
  Top 0.406: U5.15 48.81,11.44 R19.1
N$4
  Top 0.203: U1.21 39.68,21.9 R27.1
N$5
  Top 0.305: C29.2 39.75,11.64 40.39,11 40.39,9.73 U5.27
N$6
  Top 0.203: C25.1 35.43,25.89 | 35.43,27.28 35.38,27.28 Y2.P1 35.38,27.34 35.38,25.89 C25.1 | 35.38,26.06 35.59,26.06 35.59,25.89 C25.1 | R27.2 35.41,24.46 35.41,24.77 35.4,24.77 C25.1
N$7
  Top 0.406: D2.C 46.72,30.59 R7.1
N$8
  Top 0.203: U5.28 39.73,9.68
  Top 0.305: C30.2 38.33,12.14 39.75,10.72 39.75,9.73 39.73,9.71 39.73,9.68
N$9
  Top 0.305: U5.26 41.11,12.13 R22.1
N$10
  Top 0.305: U5.3 57.21,10.91 C27.2
N$13
  Top 0.305: C27.1 57.86,11.31 57.91,11.26 U5.2
N$14
  Top 0.305: C28.1 54.99,11.79 55.65,11.1 56.16,11.1 56.54,10.72 56.54,9.73 U5.4
N$15  (via drill 0.3)  (1 unrouted)
  Top 0.305: U5.5 55.81,8.06 v55.8,8.05 | v52.38,11.69 53.29,11.69 C28.2
  Bottom 0.305: 52.3,11.61 v52.38,11.69 | v55.8,8.05 55.4,8.05 52.43,11.03 52.43,11.59 52.32,11.69
N$20
  Top 0.203: U5.14 49.51,9.67 49.53,9.66 | 49.02,13.15 R16.1 | D7.+
  Top 0.305: D7.+ 49.02,13.15 49,13.13 49,12.91 49.53,12.37 49.53,9.66 49.53,9.6 49.51,9.58 | C26.2 48.92,14.61 D7.+
QSPI-0  (via drill 0.3)
  Top 0.203: U3.5 v56.9,25.1 | U1.53 50.65,23.1 51.49,23.93 v51.77,23.93
  Bottom 0.203: v51.77,23.93 56.46,23.93 56.9,24.36 v56.9,25.1
QSPI-1
  Top 0.203: U1.55 50.06,23.9 50.34,24.18 50.34,25.84 50.75,26.24 50.75,27.08 51.31,27.64 U3.2
QSPI-2
  Top 0.203: U3.3 51.45,26.36 50.78,25.68 50.78,23.9 50.37,23.5 U1.54
QSPI-3  (via drill 0.3)
  Top 0.203: U3.7 59.95,27.61 v57.81,27.61 | U1.51 51.55,22.3 v51.77,22.51
  Bottom 0.203: v51.77,22.51 56.87,22.51 58.01,23.65 58.01,27.41 v57.81,27.61
QSPI-CLK  (via drill 0.3)
  Top 0.203: U1.52 50.94,22.7 51.44,23.19 v52.27,23.19 | U3.6 v57.35,26.37
  Bottom 0.203: v52.27,23.19 56.69,23.19 57.56,24.06 57.56,26.16 v57.35,26.37
QSPI-CS  (via drill 0.3)
  Top 0.203: 50.32,28.45 50.32,26.55 49.43,25.66 U1.56 | 50.32,28.45 v50.32,28.76 50.32,28.85 50.37,28.9 | U3.1 50.37,28.9 | 50.37,28.9 49.49,28.9 R25.2 | 50.32,28.45 49.89,28.88 50.7,28.88 50.7,28.83 50.34,28.48 50.34,28.65 50.52,28.83 50.24,28.83 50.17,28.76 50.62,28.76 50.75,28.88 | R26.2 31.13,31.39 31.98,30.53 31.98,25.66 v33.17,24.46
  Bottom 0.203: v50.32,28.76 47.6,28.78 45.8,28.78 42.06,25.05 33.76,25.05 v33.17,24.46
SCL  (via drill 0.3)
  Top 0.203: U1.9 45.4,26.6 v45.7,26.9 | v52.22,15.55 52.22,17.76 v51.51,18.37
  Top 0.305: R17.1 25.91,2.24 26.57,1.58 27.89,1.58 29.52,3.2 33.63,3.2 34.98,4.55 43.59,4.55 v46.63,7.6 46.71,7.68 U5.18
  Bottom 0.203: v46.63,7.6 48.72,9.68 48.72,14.05 49.53,14.86 51.54,14.86 v52.22,15.55 | v51.51,18.37 51.54,21.95 50.93,22.56 50.93,24.31 49.91,25.33 47.57,25.33 47.22,25.68 47.22,26.44 46.69,26.98 45.77,26.98 v45.7,26.9
SDA  (via drill 0.3)  (2 unrouted)
  Top 0.203: U5.20 46.03,9.7 | 46.03,9.7 46.05,9.68 46.03,9.7 | U1.8 45.8,25.78 46.05,26.04 v46.38,26.04 | v50.6,18.52 50.6,18.27 51.41,17.45 51.41,16.46 v51.56,16.31 | 45.29,9.5 46.01,9.5 | 45.31,9.29 46.03,9.29
  Top 0.305: U5.20 45.31,9.29 45.31,8.46 v44.6,7.75 43.41,6.56 35.97,6.56 33.53,4.12 28.83,4.12 R18.1
  Bottom 0.203: v44.6,7.75 47.57,10.72 47.57,15.09 47.9,15.42 51.08,15.42 51.56,15.9 v51.56,16.31 | v46.38,26.04 46.46,26.04 46.66,25.84 46.66,25.33 47.09,24.89 49.43,24.89 50.44,23.88 50.44,22.36 51.13,21.67 51.13,19.1 v50.6,18.52
SDIO_DAT1  (via drill 0.3)
  Top 0.203: U1.14 42.21,26.32 v42.04,26.32 | SD.8 15.09,22.3 15.61,22.83 R14.1 15.61,29.15 16.15,29.7 17.48,29.7 18.31,28.86 19.96,28.86 20.68,29.57 v20.68,30.38 | 27.53,28.76 v27.56,28.76 27.46,28.86 27.46,29.49 26.57,30.38 v26.37,30.38
  Bottom 0.203: v42.04,26.32 37.47,26.32 35.03,28.76 v27.56,28.76 | v20.68,30.38 v26.37,30.38
SDIO_DAT2  (via drill 0.3)  (2 unrouted)
  Top 0.203: U1.13 43.8,25.75 42.57,26.98 v41.2,26.98 | SD.1 10.27,14.6 7.62,17.25 7.62,28.81 6.91,28.81 v6.55,28.58
  Bottom 0.203: v41.2,26.98 37.69,26.98 v32.95,31.72 | v6.55,28.58 7.24,28.63 7.8,29.19 26.09,29.21 27.58,30.71 30.07,30.69 31.12,31.73 v32.94,31.73
SPI0_MISO  (via drill 0.3)  (1 unrouted)
  Top 0.203: U1.27 41.92,19.5 41.68,19.26 41.68,18.62 v41.83,18.47 | U4.2 28.72,26.16 v25.25,22.68 v21.97,19.41 21.97,19.43 | 14.2,28.81 14.2,28.55 12.65,27 12.65,21.92 13.37,21.2 SD.7 18.25,21.2 v18.36,21.09
  Bottom 0.203: v25.25,22.68 25.25,22.66 28.85,19.05 41.25,19.05 v41.83,18.47 | v18.36,21.09 20.35,21.09 v21.97,19.41
SPI0_MOSI  (via drill 0.3)
  Top 0.203: U4.3 26.72,26.29 25.96,25.53 25.1,25.53 v23.6,24.03 v18.92,19.36 | U1.30 43.8,17.77 43.1,17.07 43.1,16.69 v42.82,16.41 | R11.1 10.19,28.74 10.19,17.88 11.27,16.8 SD.3 v15.89,16.8
  Bottom 0.203: v23.6,24.03 23.6,23.3 28.27,18.62 40.59,18.62 41.45,17.76 42.9,17.76 43.1,17.55 43.1,16.69 v42.82,16.41 | v18.92,19.36 18.92,19.28 16.46,16.82 15.91,16.82 v15.89,16.8
SPI0_SCK  (via drill 0.3)
  Top 0.203: U4.4 24.72,26.33 v22.63,24.23 17.4,19 SD.5 13.72,19 12.5,20.22 12.47,20.25 12.09,20.63 12.09,27.51 12.47,27.89 12.47,28.57 R12.1 | U1.29 43.4,18.13 v42.39,17.12
  Bottom 0.203: v22.63,24.23 22.63,23.62 28.07,18.19 40.31,18.19 41.38,17.12 v42.39,17.12
SPI0_SS  (via drill 0.3)
  Top 0.203: U4.5 22.72,25.37 v21.69,24.34 21.69,24.21 | U1.28 42.56,18.26 41.71,17.4 41.71,16.31 | 41.71,16.31 41.71,15.6 42.23,15.07 42.23,13.8 42.55,13.49 42.55,13.62 | v41.85,16.34 41.73,16.34 41.71,16.31 | 42.55,13.62 42.52,13.64 | R5.1 42.55,13.62
  Bottom 0.203: v21.69,24.34 21.69,23.85 27.79,17.76 39.98,17.76 41.4,16.34 v41.85,16.34
SWDCK  (via drill 0.3)
  Top 0.203: U1.24 40.76,20.7 40.34,20.27 40.31,16.2 40.31,16.08 v39.85,15.62
  Bottom 0.203: v39.85,15.62 33.53,15.62 32.31,14.4 32.31,7.66 J11.3
SWDIO  (1 unrouted)
  Top 0.203: U1.25 41.05,20.3 40.77,20.02 40.77,15.41 40.71,15.41 39.75,14.46 37.39,14.46 36.7,13.77 36.7,9.53 33.58,6.4
TFT  (via drill 0.3)  (1 unrouted)
  Top 0.203: U1.4 47.4,25.76 47.57,25.94 48.08,25.94 v47.96,26.06 | R30.2 65.08,26.82 65.51,27.26 65.51,29.01 64.41,30.1 63.2,30.1 v62.74,29.64
  Bottom 0.203: v62.74,29.64 62.74,29.67 62.76,29.7 53.11,29.7 49.43,26.01 47.96,26.01 v47.96,26.06
USB_F_N
  Top 0.203: U1.46 52.81,20.3 R29.1
USB_F_P
  Top 0.203: U1.47 52.79,20.7 R28.1
USB_N  (via drill 0.3)
  Top 0.203: 55.57,19.71 58.83,19.71 60.76,17.79 | 60.76,17.81 60.76,17.79 | 60.76,17.79 62.44,16.11 62.44,16.1 v62.89,15.65
  Top 0.254: R29.2 55.57,19.71
  Bottom 0.203: X1.2 63.29,15.25 v62.89,15.65 63.3,15.24 64.72,15.24
USB_P  (via drill 0.3)
  Top 0.203: R28.2 57.99,21.36 62.81,16.54 v62.87,16.72
  Bottom 0.203: v62.87,16.72 65.86,16.72 66.37,17.22 X1.3
V_USB  (via drill 0.3)
  Top 0.406: U2.3 61.1,15.02 60.58,14.51 60.58,12.09 60.88,11.79
  Top 0.813: v62.84,11.23 62.04,11.23 C3.1 | v62.84,12.88 62.84,11.31 62.81,11.28 60.59,11.28 C1.1 60.88,11.79 61.62,12.53 61.62,13.02 U2.1
  Bottom 0.813: X1.1 62.97,12.75 v62.84,12.88 v62.84,12.07 v62.84,11.23

### Text on the board
tPlace: 3V3 | GND | DCK | DIO
bPlace: RFM98W 433MHz | RFM95W 868MHz | RFM95W 915MHz | SenseLoRa | LoRa Receiver V1.0 | www.makerfabs.com
tNames: J1